# Altium schematic sheet MCU.SchDoc
size A4; SheetNumber: 5; SheetTotal: 11
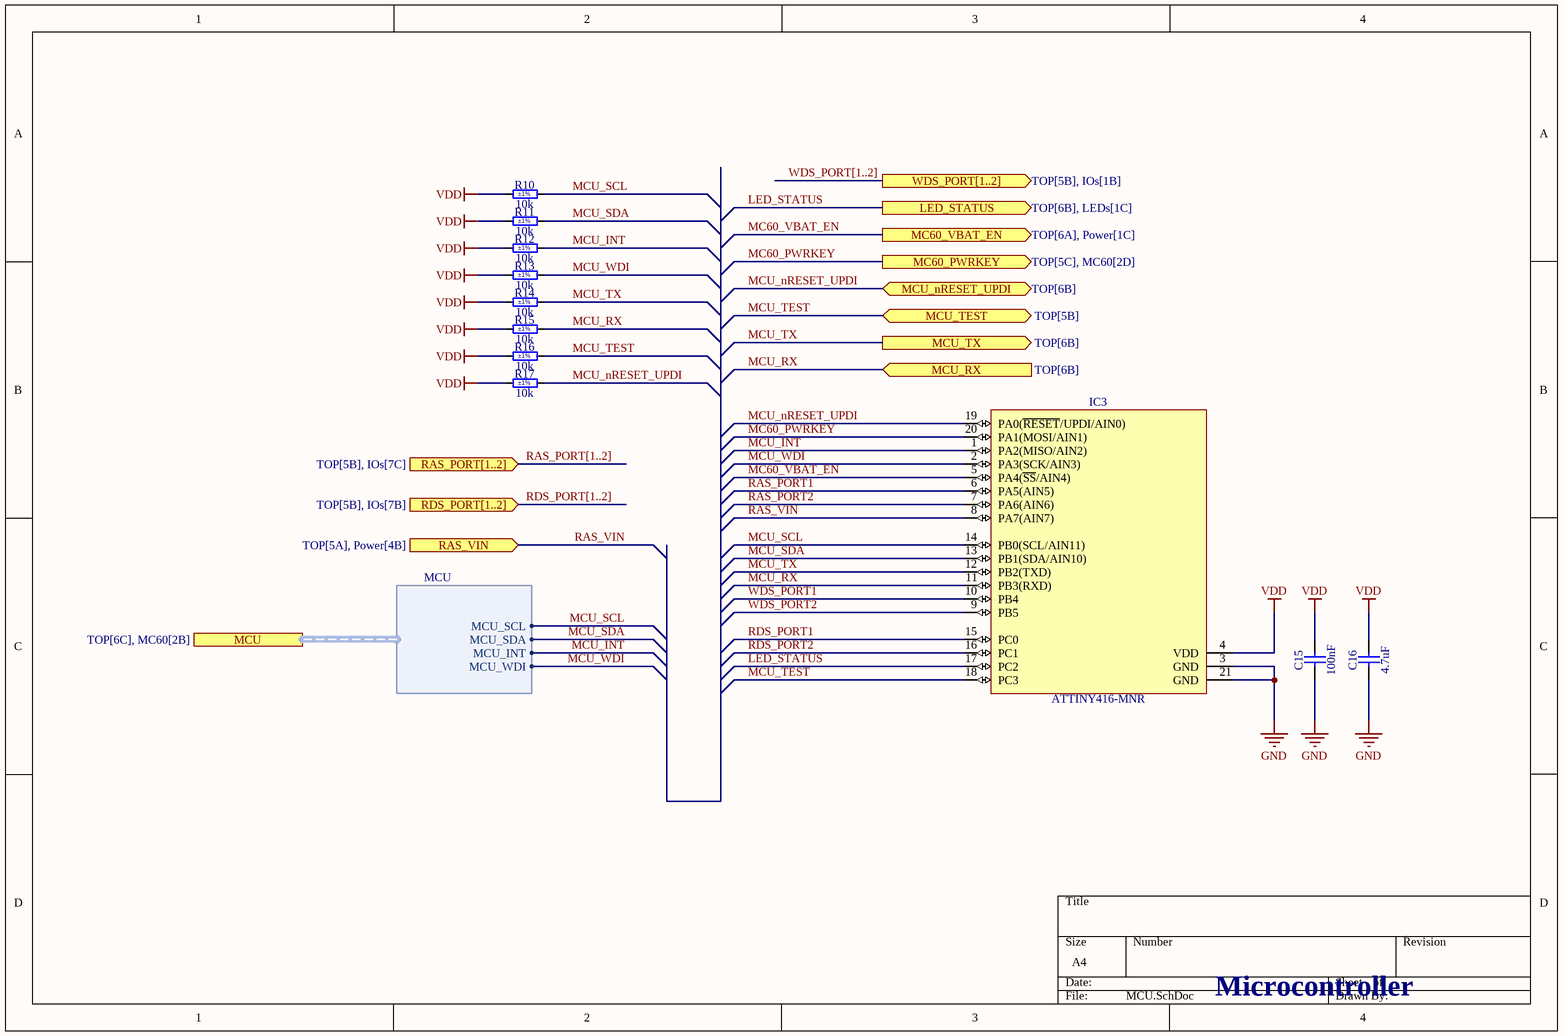
[diagram p0: MCU.SchDoc]

## Parts
C15  100nF  [CAPC1608X87N]
C16  4.7uF  [CAPC1709X95N]
IC3  ATTINY416-MNR  [QFN40P300X300X80-21N-S180]
R10  10k  Tolerance: ±1%  [RESC1608X55N]
R11  10k  Tolerance: ±1%  [RESC1608X55N]
R12  10k  Tolerance: ±1%  [RESC1608X55N]
R13  10k  Tolerance: ±1%  [RESC1608X55N]
R14  10k  Tolerance: ±1%  [RESC1608X55N]
R15  10k  Tolerance: ±1%  [RESC1608X55N]
R16  10k  Tolerance: ±1%  [RESC1608X55N]
R17  10k  Tolerance: ±1%  [RESC1608X55N]

## Ports
LED_STATUS (out, see TOP[6B], LEDs[1C]), MC60_PWRKEY (out, see TOP[5C], MC60[2D]), MC60_VBAT_EN (out, see TOP[6A], Power[1C]), MCU (harness MCU, see TOP[6C], MC60[2B]), MCU_nRESET_UPDI (bidir, see TOP[6B]), MCU_RX (in, see TOP[6B]), MCU_TEST (bidir, see TOP[5B]), MCU_TX (out, see TOP[6B]), RAS_PORT[1..2] (in, see TOP[5B], IOs[7C]), RAS_VIN (in, see TOP[5A], Power[4B]), RDS_PORT[1..2] (in, see TOP[5B], IOs[7B]), WDS_PORT[1..2] (out, see TOP[5B], IOs[1B])

## Harnesses
MCU: MCU_SCL, MCU_SDA, MCU_INT, MCU_WDI

## Nets
GND: C15.1 C16.1 IC3.3(GND) IC3.21(GND)
VDD: C15.2 C16.2 IC3.4(VDD) R10.1 R11.1 R12.1 R13.1 R14.1 R15.1 R16.1 R17.1
LED_STATUS: IC3.17(PC2) ; port LED_STATUS
MC60_PWRKEY: IC3.20(PA1(MOSI/AIN1)) ; port MC60_PWRKEY
MC60_VBAT_EN: IC3.5(PA4(~{SS}/AIN4)) ; port MC60_VBAT_EN
MCU_INT: IC3.1(PA2(MISO/AIN2)) R12.2 ; port MCU.MCU_INT
MCU_nRESET_UPDI: IC3.19(PA0(~{RESET}/UPDI/AIN0)) R17.2 ; port MCU_nRESET_UPDI
MCU_RX: IC3.11(PB3(RXD)) R15.2 ; port MCU_RX
MCU_SCL: IC3.14(PB0(SCL/AIN11)) R10.2 ; port MCU.MCU_SCL
MCU_SDA: IC3.13(PB1(SDA/AIN10)) R11.2 ; port MCU.MCU_SDA
MCU_TEST: IC3.18(PC3) R16.2 ; port MCU_TEST
MCU_TX: IC3.12(PB2(TXD)) R14.2 ; port MCU_TX
MCU_WDI: IC3.2(PA3(SCK/AIN3)) R13.2 ; port MCU.MCU_WDI
RAS_PORT1: IC3.6(PA5(AIN5))
RAS_PORT2: IC3.7(PA6(AIN6))
RAS_VIN: IC3.8(PA7(AIN7)) ; port RAS_VIN
RDS_PORT1: IC3.15(PC0)
RDS_PORT2: IC3.16(PC1)
WDS_PORT1: IC3.10(PB4)
WDS_PORT2: IC3.9(PB5)

## Buses and harness runs
bus RAS_PORT[1..2] = port RAS_PORT[1..2]
bus RDS_PORT[1..2] = port RDS_PORT[1..2]
bus WDS_PORT[1..2] = port WDS_PORT[1..2]

## Notes on the sheet
- Microcontroller

## Library data of the parts
C15 = CC0603_100NF_50V_10%_X7R: Non-polarised capacitor; Part Description: SMD Multilayer Chip Ceramic Capacitor; Manufacturer: GENERIC; Manufacturer1 Part Number: 223858615649; Voltage: 50V; TC: X7R; Tolerance: ±10%; Part Number: CC0603_100NF_50V_10%_X7R; Component Kind: Standard; Component Type: Standard; Pin Count: 2; Value: 100nF; Status: Preferred; Manufacturer Part Number: CC0603_100NF_50V_10%_X7R; Case: 0603; Mounted: Yes; Socket: No; SMD: Yes; Sense: No; Manufacturer1 Example: PHYCOMP; Manufacturer1 ComponentHeight: 0.87mm; HelpURL: \\cern.ch\dfs\Applications\Altium\Datasheets\CC0603_X7R_PHYCOMP.pdf; Author: CERN DEM JLC; CreateDate: 03.12.2007; LatestRevisionDate: 03.12.2007
C16 = CC0603_4.7UF_16V_10%_X5R: Non-polarised capacitor; Part Description: SMD Multilayer Chip Ceramic Capacitor; Manufacturer: GENERIC; Manufacturer1 Part Number: EMK107ABJ475KA-T; Voltage: 16V; TC: X5R; Tolerance: ±10%; Part Number: CC0603_4.7UF_16V_10%_X5R; Component Kind: Standard; Component Type: Standard; Pin Count: 2; Value: 4.7uF; Status: None; Manufacturer Part Number: CC0603_4.7UF_16V_10%_X5R; Case: 0603; Mounted: Yes; Socket: No; SMD: Yes; Sense: No; Manufacturer1 Example: TAIYO YUDEN; Manufacturer1 ComponentHeight: 0.95mm; HelpURL: \\cern.ch\dfs\Applications\Altium\Datasheets\CC0603_X7R_TAIYO-YUDEN_HIGH-VALUE.pdf; Author: CERN DEM JLC; CreateDate: 16.12.2013; LatestRevisionDate: 16.09.2014
IC3 = ATTINY416-MNR: AVR tinyAVR™ 1, Functional Safety (FuSa) Microcontroller IC 8-Bit 20MHz 4KB (4K x 8) FLASH 20-VQFN (3x3); Manufacturer: MICROCHIP TECHNOLOGY; PressFit: No; Bonding: No; Part Number: ATTINY416-MNR; Component Kind: Standard; Component Type: Standard; Device: ATTINY416-MNR; PackageDescription: QFN, 0.40mm Pitch, Square, 20 Pin, 3.00mm L X 3.00mm W X 0.80mm H body (w/thermal tab); Part Description: AVR tinyAVR™ 1, Functional Safety (FuSa) Microcontroller IC 8-Bit 20MHz 4KB (4K x 8) FLASH 20-VQFN (3x3); Manufacturer Part Number: ATTINY416-MNR; Pin Count: 21; Case: QFN20; Mounted: Yes; Socket: No; SMD: Yes; Sense: No; ComponentHeight: 0.85mm; HelpURL: https://ww1.microchip.com/downloads/en/DeviceDoc/ATtiny212-214-412-414-416-DataSheet-DS40002287A.pdf; Author: Xusniyor; CreateDate: 22.04.2023; LatestRevisionDate: 22.04.2023
R10-R17 = R0603_10K_1%_0.1W_100PPM: Resistor - 1%; Part Description: General Purpose Thick Film Chip Resistor; Manufacturer: GENERIC; Manufacturer1 Part Number: NRC06F1002TRF; Power: 0.1W; TC: ±100ppm/°C; PressFit: No; Part Number: R0603_10K_1%_0.1W_100PPM; Component Kind: Standard; Component Type: Standard; Pin Count: 2; Value: 10k; Status: Preferred; Manufacturer Part Number: R0603_10K_1%_0.1W_100PPM; Case: 0603; Mounted: Yes; Sense: No; Socket: No; SMD: Yes; Manufacturer1 Example: NIC COMPONENT; Manufacturer1 ComponentHeight: 0.55mm; HelpURL: \\cern.ch\dfs\Applications\Altium\Datasheets\R0603_NIC_NRC.pdf; Author: CERN DEM JLC; CreateDate: 03.12.2007; LatestRevisionDate: 13.03.2008